# Altium schematic sheet CommonComponents.SchDoc
size 431 x 279 mm; SheetNumber: 9; SheetTotal: 10
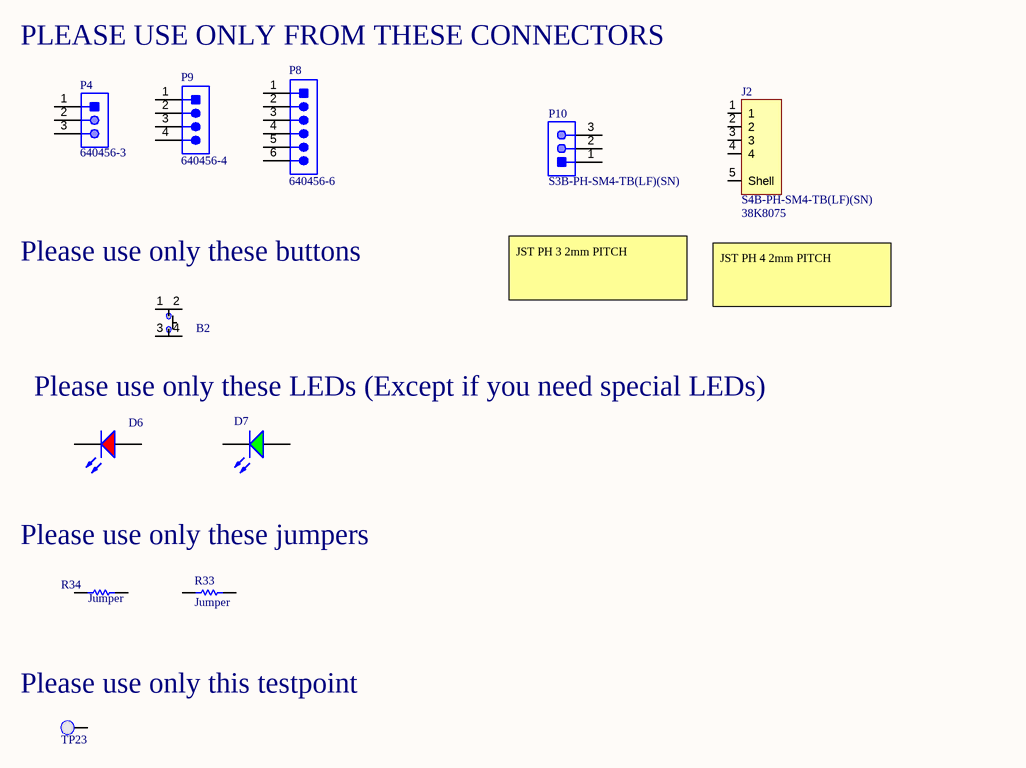
[diagram p0: CommonComponents.SchDoc]

## Parts
B2  PTS810 SJK 250 SMTR LFS  [PTS810 SJK 250 SMTR LFS]  (value not drawn)
D6  LTST-C170CKT  [LTST-C170CKT_V]  (value not drawn)
D7  LTST-C170GKT  [LTST-C170GKT_V]  (value not drawn)
J2  S4B-PH-SM4-TB(LF)(SN)  Supplier Part Number 1: 38K8075  [S4B-PH-SM4-TB(LF)(SN)]
P4  640456-3  [TECO-640456-3]
P8  640456-6  [TECO-640456-6_V]
P9  640456-4  [TECO-640456-4]
P10  S3B-PH-SM4-TB(LF)(SN)  [JST-S3B-PH-SM4-TB-3_V]
R33  Jumper  [RESC0805(2012)_N]
R34  Jumper  [RESC0603(1608)_N]
TP23  0.1" Pad  [PCBComponent]  (value not drawn)

## Nets

Not connected (* = marked no-connect by the designer): B2 1 2 3 4; D6 1(A) 2(K); D7 1(A) 2(K); J2 1 2 3 4 5(Shell); P4 1 2 3; P8 1 2 3 4 5 6; P9 1 2 3 4; P10 1 2 3; R33 1 2; R34 1 2; TP23 1(PAD)

## Notes on the sheet
- PLEASE USE ONLY FROM THESE CONNECTORS
- (near B2) Please use only these buttons
- JST PH 3 2mm PITCH
- JST PH 4 2mm PITCH
- Please use only these LEDs (Except if you need special LEDs)
- Please use only these jumpers
- (near TP23) Please use only this testpoint
- DWG. NO.
- REV.
- SHT.
- THIS DOCUMENT AND THE DATA DISCLOSED HEREIN OR HEREWITH IS THE PROPERTY OF ALTIUM LIMITED AND MAY BE FREELY DISTRIBUTED IN WHOLE. NO RIGHTS ARE RESERVED OR EXPRESS OR IMPLIED WARANTEE GIVEN.
- REVISION
- DESCRIPTION
- DATE
- APPROVED
- ENG:
- APPROVALS
- PROJECT
- DSN:
- CHK:
- REFERENCE DOCUMENTS
- PROJECT REVISION:
- TITLE
- DOCUMENT REVISION:
- DESIGN ITEM:
- BOM:
- FAB DWG:
- PCB DWG:
- ASSY DWG:
- SCALE:
- SIZE
- B
- CAGE CODE
- FILE NAME
- DWG NO.
- SHEET
- OF
- REV

## Library data of the parts
B2 = PTS810 SJK 250 SMTR LFS: SWITCH TACTILE SPST-NO 0.05A 16V Tactile Switch SPST-NO Top Actuated Surface Mount; Manufacturer: ITT /  C&K Components; Part # Aliases: Y97LT25B5DBFP; Operating Force: 2.6 N; Actuator: Oval; Current Rating: 50 mA; Voltage Rating DC: 16 VDC; Contact Form: SPST; Switch Function: OFF - (ON); Mounting Direction: Straight; Stem Height: 2.5 mm; Brand: C&K Components; Travel: 0.15 mm; Manufacturer Part Number: PTS810SJK250SMTRLFS; Product Category: Tactile Switches; RoHS: Details; Termination Style: J Form Lead; Mounting Style: SMD/SMT; Color: White; Packaging: Reel; Contact Plating: Silver; Operating Temperature Range: - 40 C to + 85 C; Series: PTS810; Factory Pack Quantity: 2900; ComponentLink1URL: https://datasheet.ciiva.com/18514/pts810-4mar13-18514061.pdf; ComponentLink1Description: https://datasheet.ciiva.com/18514/pts810-4mar13-18514061.pdf; ComponentLink2URL: https://datasheet.ciiva.com/18514/pts810-4mar13-18514062.pdf; ComponentLink2Description: https://datasheet.ciiva.com/18514/pts810-4mar13-18514062.pdf; ComponentLink3URL: https://datasheet.ciiva.com/18514/pts810-4mar13-18514063.pdf; ComponentLink3Description: https://datasheet.ciiva.com/18514/pts810-4mar13-18514063.pdf; Supplier 1: Digi-Key; Supplier Part Number 1: CKN10503CT-ND
D6 = CMP-1674-00001-5: LED Uni-Color Red, 100 mW, 200 mA, -55 to 85 degC, 2-Pin SMD, RoHS, Tape and Reel; Manufacturer: Lite-On; PackageReference: C170CKT; ComponentLink1Description: Manufacturer URL; ComponentLink1URL: http://www.us.liteon.com/; Package Quantity: 3000; Packaging: Tape and Reel; Pins: 2; ComponentLink2URL: http://media.digikey.com/pdf/Data%20Sheets/Lite-On%20PDFs/LTST-C170CKT.pdf; Max Operating Temperature: 85 degC; Min Operating Temperature: -55 degC; Mounting Technology: Surface Mount; Mount: Surface Mount; Length: 2 mm; ComponentLink2Description: Datasheet; DatasheetVersion: 03/2003; Height: 1.1 mm; PackageDescription: 2-Pin Surface Mount Device, Body 2 x 1.25 mm; RoHSCompliant: true; Colour: Red
D7 = CMP-1674-00002-5: LED Uni-Color Green, 100 mW, 120 mA, -55 to 85 degC, 2-Pin SMD, RoHS, Tape and Reel; Manufacturer: Lite-On; PackageReference: C170GKT; ComponentLink1Description: Manufacturer URL; ComponentLink1URL: http://www.us.liteon.com/; Height: 1.1 mm; PackageDescription: 2-Pin Surface Mount Device, Body 2 x 1.25 mm; RoHSCompliant: true; Package Quantity: 1; Packaging: Tape and Reel; Mount: Surface Mount; Min Operating Temperature: -55 degC; DatasheetVersion: 03/2003; Max Operating Temperature: 85 degC; Pins: 2; Mounting Technology: Surface Mount; Length: 2 mm; Colour: Green; ComponentLink2URL: http://media.digikey.com/pdf/Data%20Sheets/Lite-On%20PDFs/LTST-C170GKT.pdf; ComponentLink2Description: Datasheet
J2 = S4B-PH-SM4-TB(LF)(SN): JST (JAPAN SOLDERLESS TERMINALS) - S4B-PH-SM4-TB(LF)(SN) - Wire-To-Board Connector, 2 mm, 4 Contacts, Header, PH Series, Surface Mount, 1 Rows; Number of Positions: 4; Insulation Resistance: 1GR; Gender: Male; Current Rating: 2A; Voltage Rating: 100V; Connector Type: Header,Male Pin; Contact Resistance: 20mR; Pitch: 2mm; Supplier 1: Newark; Manufacturer: JST; Manufacturer Part Number: S4B-PH-SM4-TB(LF)(SN); RoHS: Yes; Category: Connectors; Mount: Surface Mount; Housing Material: Polyamide; Color: Natural,White; Contact Material: Copper Alloy,Tin,Bronze,Brass; Contact Plating: Tin,Copper; Housing Color: Beige; Contact Shape: Square; Insulation Material: Nylon; Insulation Color: Natural; Min Operating Temperature: -25°C; Max Operating Temperature: 85°C; Termination: Solder; Number of Contacts: 4; Number of Rows: 1; Packaging: Tape and Reel; Voltage Rating (AC): 100V; Orientation: Right Angle; Fastening Type: Detent; Working Voltage: 100V; Max Voltage Rating (AC): 100V; Max Voltage Rating (DC): 100V; Number of Poles: 4; Max Current Rating: 2A; Length: 11.9mm; Width: 5mm; Height: 9.4mm; Contact Mating Length: 0.13inch; Depth: 7.6mm; Lead Pitch: 2mm; Lead Free: Lead Free; REACH SVHC: No SVHC; Flammability Rating: UL94 V-0; ComponentLink1URL: https://datasheet.ciiva.com/11746/0900766b80df0d9d-11746552.pdf?src-supplier=RSComponents; ComponentLink1Description: https://datasheet.ciiva.com/11746/0900766b80df0d9d-11746552.pdf?src-supplier=RSComponents; ComponentLink2URL: https://datasheet.ciiva.com/712/eph-712578.pdf?src-supplier=Digi-Key; ComponentLink2Description: https://datasheet.ciiva.com/712/eph-712578.pdf?src-supplier=Digi-Key; ComponentLink3URL: https://datasheet.ciiva.com/712/eph-712579.pdf?src-supplier=Digi-Key; ComponentLink3Description: https://datasheet.ciiva.com/712/eph-712579.pdf?src-supplier=Digi-Key; ComponentLink4URL: https://datasheet.ciiva.com/730/eph-730675.pdf?src-supplier=Digi-Key; ComponentLink4Description: https://datasheet.ciiva.com/730/eph-730675.pdf?src-supplier=Digi-Key; ComponentLink5URL: https://datasheet.ciiva.com/8052/1699381-8052234.pdf?src-supplier=Element14; ComponentLink5Description: https://datasheet.ciiva.com/8052/1699381-8052234.pdf?src-supplier=Element14; ComponentLink6URL: https://datasheet.ciiva.com/26894/getdatasheetpartid-639990-26894620.pdf?src-supplier=Verical; ComponentLink6Description: https://datasheet.ciiva.com/26894/getdatasheetpartid-639990-26894620.pdf?src-supplier=Verical; ComponentLink7URL: https://datasheet.ciiva.com/16376/eph-16376783.pdf?src-supplier=Future+Electronics; ComponentLink7Description: https://datasheet.ciiva.com/16376/eph-16376783.pdf?src-supplier=Future+Electronics
P4 = CMP-2000-05418-1: Male Header, Pitch 2.54 mm, 1 x 3 Position, Height 10.03 mm, Tail Length 3.56 mm, -55 to 105 degC; Manufacturer: TE Connectivity; Agency Approvals: CSA,UL; Angle: Straight; Number of Positions: 3; Standards: RoHSCompliant,ELVCompliant,UL94V-0; Current, Rating: 5 / A; Connector Type: MTA-100; Mount Angle: Vertical; Material, Housing: Polyester; Temperature, Operating: -55to+105 / degC; Voltage, Rating: 250 / V; Color, Housing: White; Contact Centerline Spacing: 0.100 / in.; Special Features: Pinstrip; Material, Contact: CopperAlloy; Contact Termination Area Plating: Tin; Primary Type: InterconnectSystem; Pin Spacing: 0.1 / "; Brand/Series: MTA-100Series; Mounting Hole Size: 0.04 / "; Manufacturer URL: http://www.te.com/; Datasheet URL: https://datasheet.ciiva.com/16456/eng-ds-82056-mta-0608-16456886.pdf; Flammability Rating: UL94V-0; Mounting Type: PCMount; Contact Mating Area Plating: Tin; Datasheet Version: Jun-08; Number of Rows: 1; Termination: Solder; Type: PCBPlug; Length, Pin: 0.14 / "; Color: White; Contact Plating: Tin; Contact Shape: Square; Number of Contacts: 3; Size, Post: 0.025 / in.; Length, Terminal Post: 0.14 / in.; Length, Overall: 0.3 / "
P8 = CMP-2000-05661-1: Male Header, Pitch 2.54 mm, 1 x 6 Position, Height 10.03 mm, Tail Length 3.56 mm, -55 to 105 degC, Bulk; Manufacturer: TE Connectivity; Contact Centerline Spacing: 0.100 / in.; Number of Contacts: 6; Current, Rating: 5 / A; Agency Approvals: CSA,UL; Material, Contact: CopperAlloy; Mounting Hole Size: 0.04 / "; Brand/Series: MTA-100Series; Pin Spacing: 0.1 / "; Mount Angle: Vertical; Contact Termination Area Plating: Tin; Angle: Straight; Primary Type: InterconnectSystem; Standards: RoHSCompliant,ELVCompliant,UL94V-0; Temperature, Operating: -55to+105 / °C; Material, Housing: Polyester; Special Features: Pinstrip; Color, Housing: White; Connector Type: MTA-100; Voltage, Rating: 250 / V; Termination: Solder; Package Reference: 640456-6; Size, Post: 0.025 / in.; Color: White; Datasheet URL: https://datasheet.ciiva.com/25618/0900766b80eb7fdd-25618163.pdf; Manufacturer URL: http://www.te.com/; Mounting Type: PCMount; Length, Pin: 0.14 / "; Type: PCBPlug; Length, Overall: 0.6 / "; Mounting Technology: ThroughHole; Number of Rows: 1; Contact Shape: Square; Contact Mating Area Plating: Tin; Datasheet Version: Rev. W, 05/2005; Number of Positions: 6; Package Description: Male Header, Pitch 2.54 mm, 1 x 6 Position, Height 10.03 mm, Tail Length 3.56 mm; Contact Plating: Tin; Length, Terminal Post: 0.14 / in.; Flammability Rating: UL94V-0
P9 = CMP-2000-05419-1: Male Header, Pitch 2.54 mm, 1 x 4 Position, Height 10.03 mm, Tail Length 3.56 mm, RoHS, Bulk; Manufacturer: TE Connectivity; Material, Housing: Polyester; Primary Type: InterconnectSystem; Mount Angle: Vertical; Color, Housing: White; Current, Rating: 5 / A; Agency Approvals: CSA,UL; Contact Termination Area Plating: Tin; Temperature, Operating: -55to+105 / degC; Standards: RoHSCompliant,ELVCompliant,UL94V-0; Number of Positions: 4; Brand/Series: MTA-100Series; Angle: Straight; Pin Spacing: 0.1 / "; Material, Contact: CopperAlloy; Connector Type: MTA-100; Special Features: Pinstrip; Mounting Hole Size: 0.04 / "; Contact Centerline Spacing: 0.100 / in.; Voltage, Rating: 250 / V; Manufacturer URL: http://www.te.com/; Length, Pin: 0.14 / "; Length, Overall: 0.4 / "; Color: White; Flammability Rating: UL94V-0; Mounting Type: PCMount; Termination: Solder; Datasheet URL: https://datasheet.ciiva.com/16286/eng-ds-82056-mta-0608-16286228.pdf; Number of Contacts: 4; Contact Shape: Square; Contact Mating Area Plating: Tin; Length, Terminal Post: 0.14 / in.; Size, Post: 0.025 / in.; Contact Plating: Tin; Type: PCBPlug; Datasheet Version: Dec-14; Number of Rows: 1
P10 = CMP-2000-07023-1: Disconnectable Crimp Style Connector, 2 A, 100 V, Right Angle, -25 to 85 degC, 3-Pin SMD, RoHS, Tape and Reel; Manufacturer: JST; Current Rating: 2mA; No of Positions: 3; Voltage Rating: 100V; Style/Orientation: RightAngleHeader/Plug; Pitch: 2mm; No. of Rows: 1; Mounting Technology: SurfaceMount; Package Description: 3-Pin Surface Mount Device, Body 9.9 x 7.6 mm, Pitch 2 mm; Type: WiretoBoard; Datasheet URL: https://datasheet.ciiva.com/16201/jst20s3b-ph-sm4-tb-lf-sn-16201903.pdf; Manufacturer URL: http://www.jst.com/home2.html; No. of Positions: 3; PartNumber: S3B-PH-SM4-TB; Termination: Crimp; Orientation: RightAngle; Package URL: https://datasheet.ciiva.com/16201/jst20s3b-ph-sm4-tb-lf-sn-16201903.pdf; Package Reference: S3B-PH-SM4-TB-3; Datasheet Version: 12/2012
R33 = CMP-1013-00001-1: Jumper 0805 (2012 Metric); Case-EIA: 0805; Value: 0.00 Ohm; Tolerance: None; Case-Metric: 2012; Technology: SMT; Power: None
R34 = CMP-1012-00001-1: Jumper 0603 (1608 Metric); Case-Metric: 1608; Value: 0.00 Ohm; Power: None; Case-EIA: 0603; Technology: SMT; Tolerance: None
TP23 = 0.1" Pad-A.4